# Altium schematic sheet DifferentialToSingleOutput.V03.R00.SchDoc: Señal Diferencial a Simple
size A4; SheetNumber: 5; SheetTotal: 18
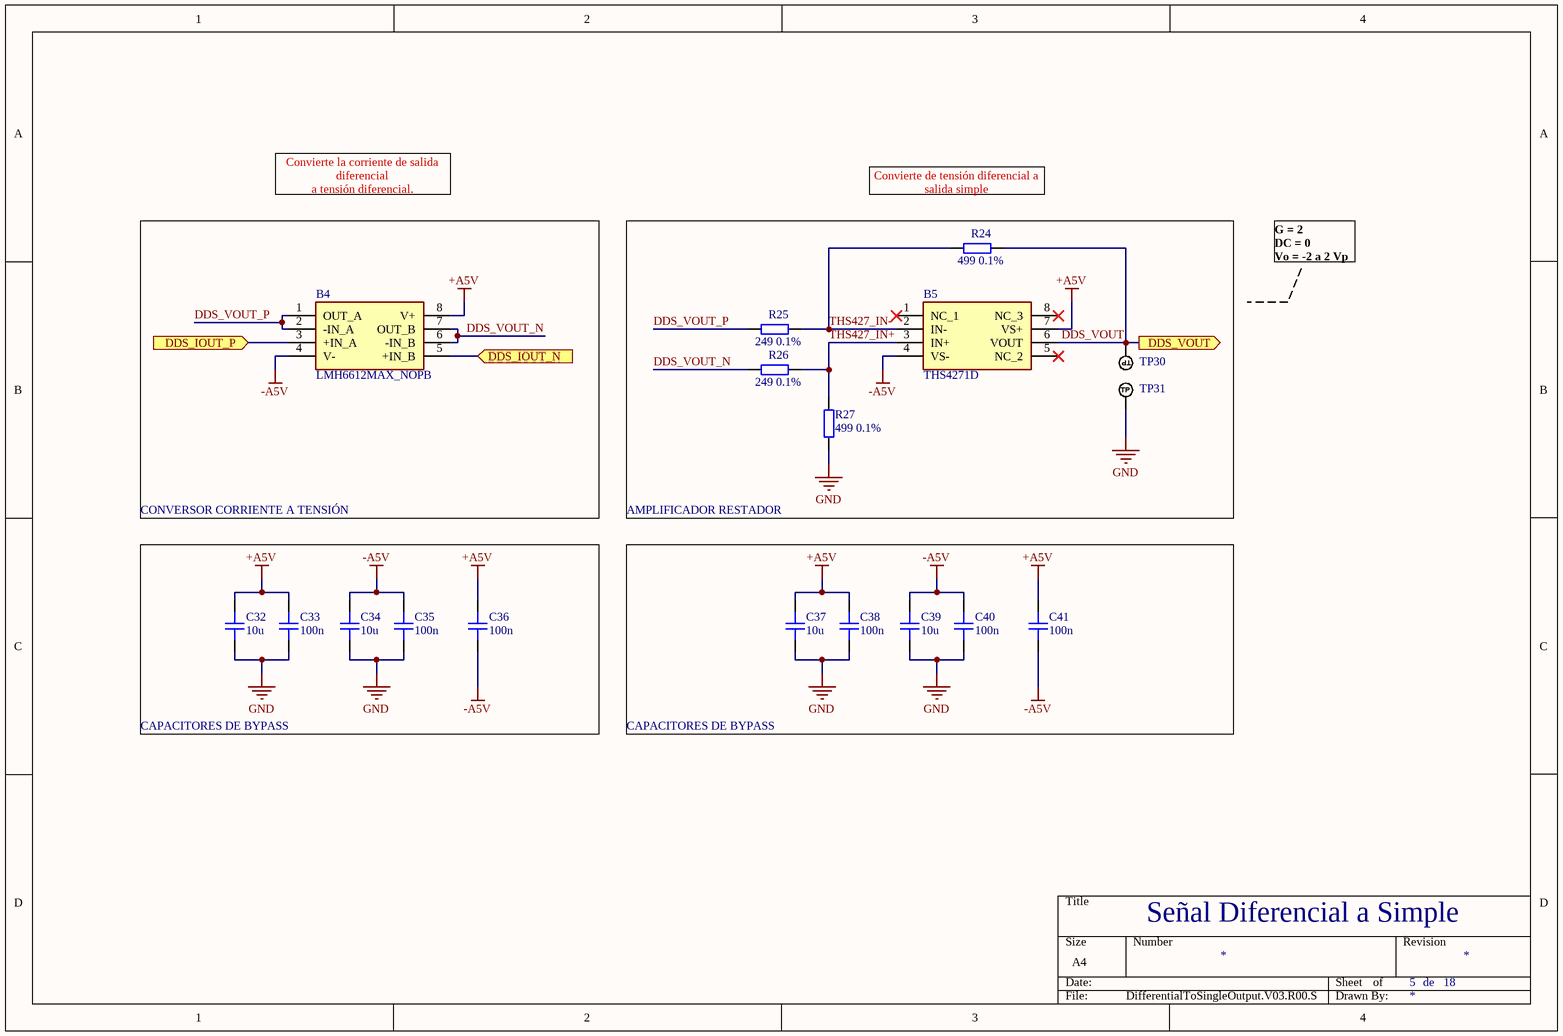
[diagram p0: DifferentialToSingleOutput.V03.R00.SchDoc]

## Parts
B4  LMH6612MAX_NOPB  [SOIC127P600X175-8N]
B5  THS4271D  [SOIC127P600X175-8N]
C32  10u  [CAP_0805]
C33  100n  [CAP_0805]
C34  10u  [CAP_0805]
C35  100n  [CAP_0805]
C36  100n  [CAP_0805]
C37  10u  [CAP_0805]
C38  100n  [CAP_0805]
C39  10u  [CAP_0805]
C40  100n  [CAP_0805]
C41  100n  [CAP_0805]
R24  499 0.1%  [RES_0805]
R25  249 0.1%  [RES_0805]
R26  249 0.1%  [RES_0805]
R27  499 0.1%  [RES_0805]
TP30  TP_NOBOM  [PAD_RND_1MM]  (value not drawn)  (no BOM)
TP31  TP_NOBOM  [PAD_RND_1MM]  (value not drawn)  (no BOM)

## Blocks framed on the sheet
CONVERSOR CORRIENTE A TENSIÓN: B4
AMPLIFICADOR RESTADOR: B5 R24-R27 TP30 TP31
CAPACITORES DE BYPASS: C32-C36
CAPACITORES DE BYPASS: C37-C41

## Ports
DDS_IOUT_N (in), DDS_IOUT_P (in), DDS_VOUT (out)

## Nets
+A5V: B4.8(V+) B5.7(VS+) C32.2 C33.2 C36.2 C37.2 C38.2 C41.2
-A5V: B4.4(V-) B5.4(VS-) C34.2 C35.2 C36.1 C39.2 C40.2 C41.1
GND: C32.1 C33.1 C34.1 C35.1 C37.1 C38.1 C39.1 C40.1 R27.1 TP31.1(TP)
DDS_IOUT_N: B4.5(+IN_B) ; port DDS_IOUT_N
DDS_IOUT_P: B4.3(+IN_A) ; port DDS_IOUT_P
DDS_VOUT: B5.6(VOUT) R24.2 TP30.1(TP) ; port DDS_VOUT
DDS_VOUT_N: B4.6(-IN_B) B4.7(OUT_B) R26.1
DDS_VOUT_P: B4.1(OUT_A) B4.2(-IN_A) R25.1
THS427_IN+: B5.3(IN+) R26.2 R27.2
THS427_IN-: B5.2(IN-) R24.1 R25.2

Not connected (* = marked no-connect by the designer): B5 1(NC_1)* 5(NC_2)* 8(NC_3)*

## Notes on the sheet
- Convierte la corriente de salida diferencial
  a tensión diferencial.
- Convierte de tensión diferencial a salida simple
- G = 2
  DC = 0
  Vo = -2 a 2 Vp
- de

## Library data of the parts
B4 = LMH6612MAX_NOPB: Single Supply, Dual 345 MHz Rail-to-Rail Output Amplifier; Manufacturer_Name: Texas Instruments; Manufacturer_Part_Number: LMH6612MAX/NOPB; Geometry.Height: 1.75mm; Mouser Part Number: 926-LMH6612MAX/NOPB; Mouser Price/Stock: https://www.mouser.co.uk/ProductDetail/Texas-Instruments/LMH6612MAX-NOPB?qs=7lkVKPoqpbYkkjxJnAARvQ%3D%3D; Datasheet Link: http://www.ti.com/lit/gpn/LMH6612
B5 = THS4271D: Super-Fast Ultra-Low Distortion High Speed Amplifier; Manufacturer_Name: Texas Instruments; Geometry.Height: 1.75mm; Mouser Part Number: 595-THS4271D; Mouser Price/Stock: https://www.mouser.co.uk/ProductDetail/Texas-Instruments/THS4271D?qs=ZmJdcv7QZ9ppdaigv2fizw%3D%3D; Manufacturer_Part_Number: THS4271D; Datasheet Link: http://www.ti.com/lit/ds/symlink/ths4271.pdf
C32-C41 = CAP_0805: Capacitor SMD 0805; Manufacturer: *; Manufacturer Part Number: *; Distributor Link: *; LCSC: *; Rating: *; Dielectric: *
R24-R27 = RES_0805: Resistor SMD 0805; Manufacturer: *; Manufacturer Part Number: *; Distributor Link: *; LCSC: *
TP30 TP31 = TEST_POINT_RND_1MM: Test Point Round 1mm (NO BOM)